# Altium schematic sheet TLC5955.SchDoc
size A4
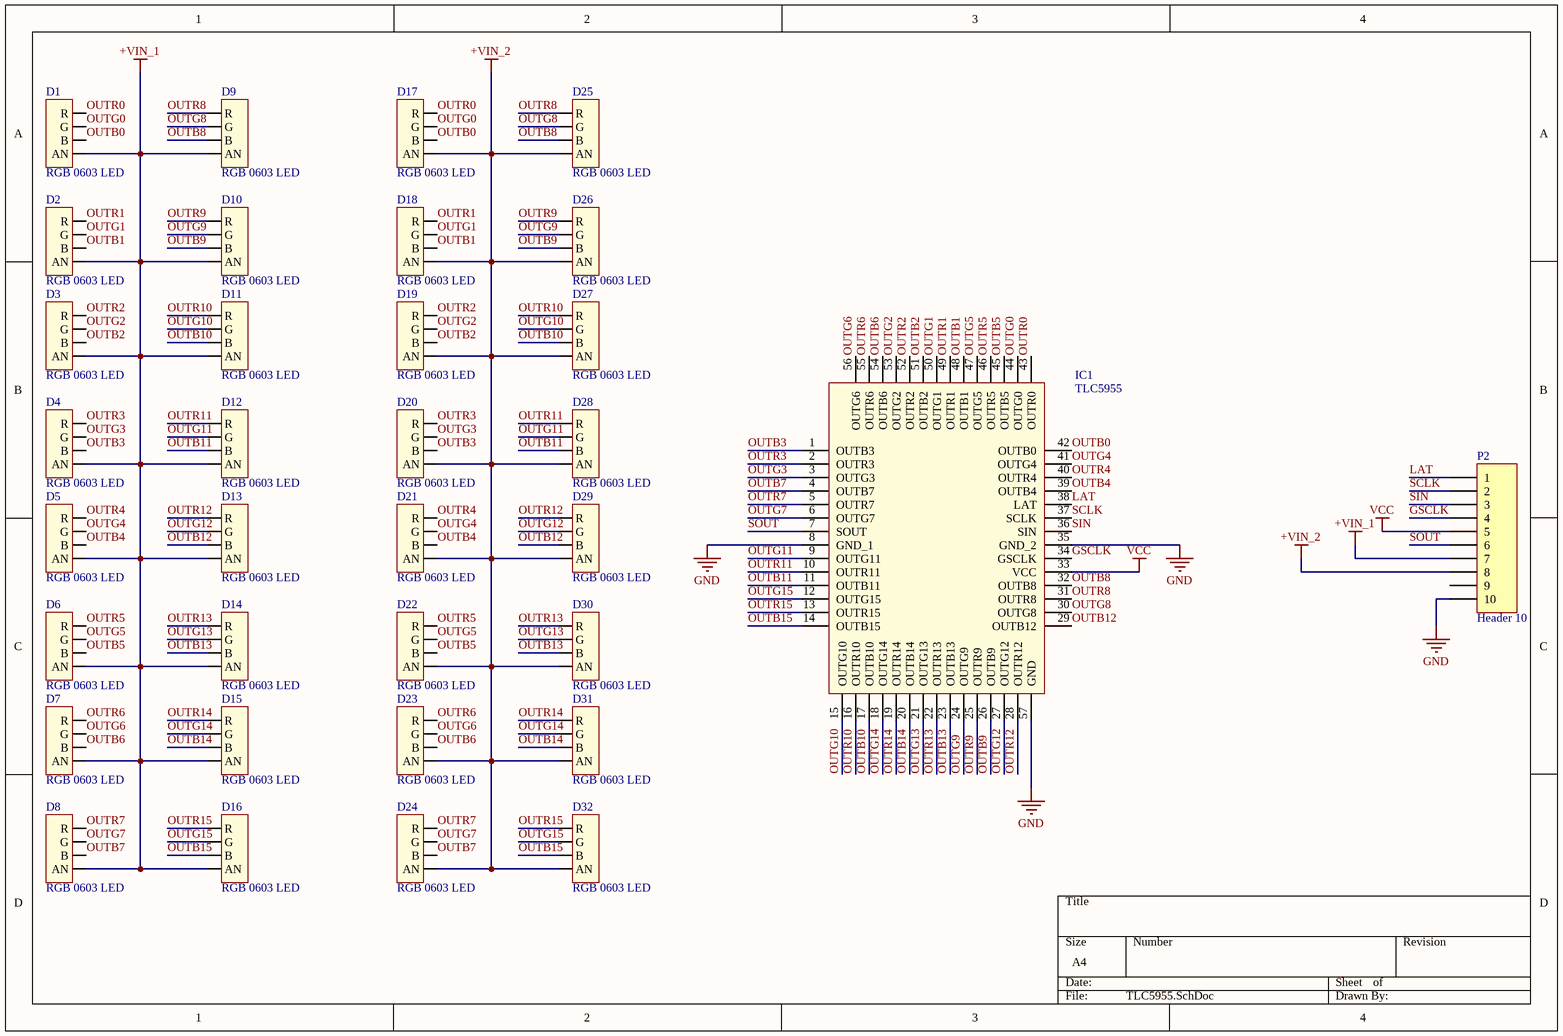
[diagram p0: TLC5955.SchDoc]

## Parts
D1  RGB 0603 LED  [RGB LED]
D2  RGB 0603 LED  [RGB LED]
D3  RGB 0603 LED  [RGB LED]
D4  RGB 0603 LED  [RGB LED]
D5  RGB 0603 LED  [RGB LED]
D6  RGB 0603 LED  [RGB LED]
D7  RGB 0603 LED  [RGB LED]
D8  RGB 0603 LED  [RGB LED]
D9  RGB 0603 LED  [RGB LED]
D10  RGB 0603 LED  [RGB LED]
D11  RGB 0603 LED  [RGB LED]
D12  RGB 0603 LED  [RGB LED]
D13  RGB 0603 LED  [RGB LED]
D14  RGB 0603 LED  [RGB LED]
D15  RGB 0603 LED  [RGB LED]
D16  RGB 0603 LED  [RGB LED]
D17  RGB 0603 LED  [RGB LED]
D18  RGB 0603 LED  [RGB LED]
D19  RGB 0603 LED  [RGB LED]
D20  RGB 0603 LED  [RGB LED]
D21  RGB 0603 LED  [RGB LED]
D22  RGB 0603 LED  [RGB LED]
D23  RGB 0603 LED  [RGB LED]
D24  RGB 0603 LED  [RGB LED]
D25  RGB 0603 LED  [RGB LED]
D26  RGB 0603 LED  [RGB LED]
D27  RGB 0603 LED  [RGB LED]
D28  RGB 0603 LED  [RGB LED]
D29  RGB 0603 LED  [RGB LED]
D30  RGB 0603 LED  [RGB LED]
D31  RGB 0603 LED  [RGB LED]
D32  RGB 0603 LED  [RGB LED]
IC1  TLC5955  [TLC5955]
P2  Header 10  [HDR1X10]

## Nets
+VIN_1: D1.4(AN) D2.4(AN) D3.4(AN) D4.4(AN) D5.4(AN) D6.4(AN) D7.4(AN) D8.4(AN) D9.4(AN) D10.4(AN) D11.4(AN) D12.4(AN) D13.4(AN) D14.4(AN) D15.4(AN) D16.4(AN) P2.7
+VIN_2: D17.4(AN) D18.4(AN) D19.4(AN) D20.4(AN) D21.4(AN) D22.4(AN) D23.4(AN) D24.4(AN) D25.4(AN) D26.4(AN) D27.4(AN) D28.4(AN) D29.4(AN) D30.4(AN) D31.4(AN) D32.4(AN) P2.8
GND: IC1.8(GND_1) IC1.35(GND_2) IC1.57(GND) P2.10
VCC: IC1.33(VCC) P2.5
GSCLK: IC1.34(GSCLK) P2.4
LAT: IC1.38(LAT) P2.1
OUTB0: D1.3(B) D17.3(B) IC1.42(OUTB0)
OUTB1: D2.3(B) D18.3(B) IC1.48(OUTB1)
OUTB2: D3.3(B) D19.3(B) IC1.51(OUTB2)
OUTB3: D4.3(B) D20.3(B) IC1.1(OUTB3)
OUTB4: D5.3(B) D21.3(B) IC1.39(OUTB4)
OUTB5: D6.3(B) D22.3(B) IC1.45(OUTB5)
OUTB6: D7.3(B) D23.3(B) IC1.54(OUTB6)
OUTB7: D8.3(B) D24.3(B) IC1.4(OUTB7)
OUTB8: D9.3(B) D25.3(B) IC1.32(OUTB8)
OUTB9: D10.3(B) D26.3(B) IC1.26(OUTB9)
OUTB10: D11.3(B) D27.3(B) IC1.17(OUTB10)
OUTB11: D12.3(B) D28.3(B) IC1.11(OUTB11)
OUTB12: D13.3(B) D29.3(B) IC1.29(OUTB12)
OUTB13: D14.3(B) D30.3(B) IC1.23(OUTB13)
OUTB14: D15.3(B) D31.3(B) IC1.20(OUTB14)
OUTB15: D16.3(B) D32.3(B) IC1.14(OUTB15)
OUTG0: D1.2(G) D17.2(G) IC1.44(OUTG0)
OUTG1: D2.2(G) D18.2(G) IC1.50(OUTG1)
OUTG2: D3.2(G) D19.2(G) IC1.53(OUTG2)
OUTG3: D4.2(G) D20.2(G) IC1.3(OUTG3)
OUTG4: D5.2(G) D21.2(G) IC1.41(OUTG4)
OUTG5: D6.2(G) D22.2(G) IC1.47(OUTG5)
OUTG6: D7.2(G) D23.2(G) IC1.56(OUTG6)
OUTG7: D8.2(G) D24.2(G) IC1.6(OUTG7)
OUTG8: D9.2(G) D25.2(G) IC1.30(OUTG8)
OUTG9: D10.2(G) D26.2(G) IC1.24(OUTG9)
OUTG10: D11.2(G) D27.2(G) IC1.15(OUTG10)
OUTG11: D12.2(G) D28.2(G) IC1.9(OUTG11)
OUTG12: D13.2(G) D29.2(G) IC1.27(OUTG12)
OUTG13: D14.2(G) D30.2(G) IC1.21(OUTG13)
OUTG14: D15.2(G) D31.2(G) IC1.18(OUTG14)
OUTG15: D16.2(G) D32.2(G) IC1.12(OUTG15)
OUTR0: D1.1(R) D17.1(R) IC1.43(OUTR0)
OUTR1: D2.1(R) D18.1(R) IC1.49(OUTR1)
OUTR2: D3.1(R) D19.1(R) IC1.52(OUTR2)
OUTR3: D4.1(R) D20.1(R) IC1.2(OUTR3)
OUTR4: D5.1(R) D21.1(R) IC1.40(OUTR4)
OUTR5: D6.1(R) D22.1(R) IC1.46(OUTR5)
OUTR6: D7.1(R) D23.1(R) IC1.55(OUTR6)
OUTR7: D8.1(R) D24.1(R) IC1.5(OUTR7)
OUTR8: D9.1(R) D25.1(R) IC1.31(OUTR8)
OUTR9: D10.1(R) D26.1(R) IC1.25(OUTR9)
OUTR10: D11.1(R) D27.1(R) IC1.16(OUTR10)
OUTR11: D12.1(R) D28.1(R) IC1.10(OUTR11)
OUTR12: D13.1(R) D29.1(R) IC1.28(OUTR12)
OUTR13: D14.1(R) D30.1(R) IC1.22(OUTR13)
OUTR14: D15.1(R) D31.1(R) IC1.19(OUTR14)
OUTR15: D16.1(R) D32.1(R) IC1.13(OUTR15)
SCLK: IC1.37(SCLK) P2.2
SIN: IC1.36(SIN) P2.3
SOUT: IC1.7(SOUT) P2.6

Not connected (* = marked no-connect by the designer): P2 9

## Library data of the parts
P2 = Header 10: Header, 10-Pin; LatestRevisionDate: 17-Jul-2002; LatestRevisionNote: Re-released for DXP Platform.; Publisher: Altium Limited